# Altium schematic sheet BlancerCarMicrocontrollers.SchDoc
size A4
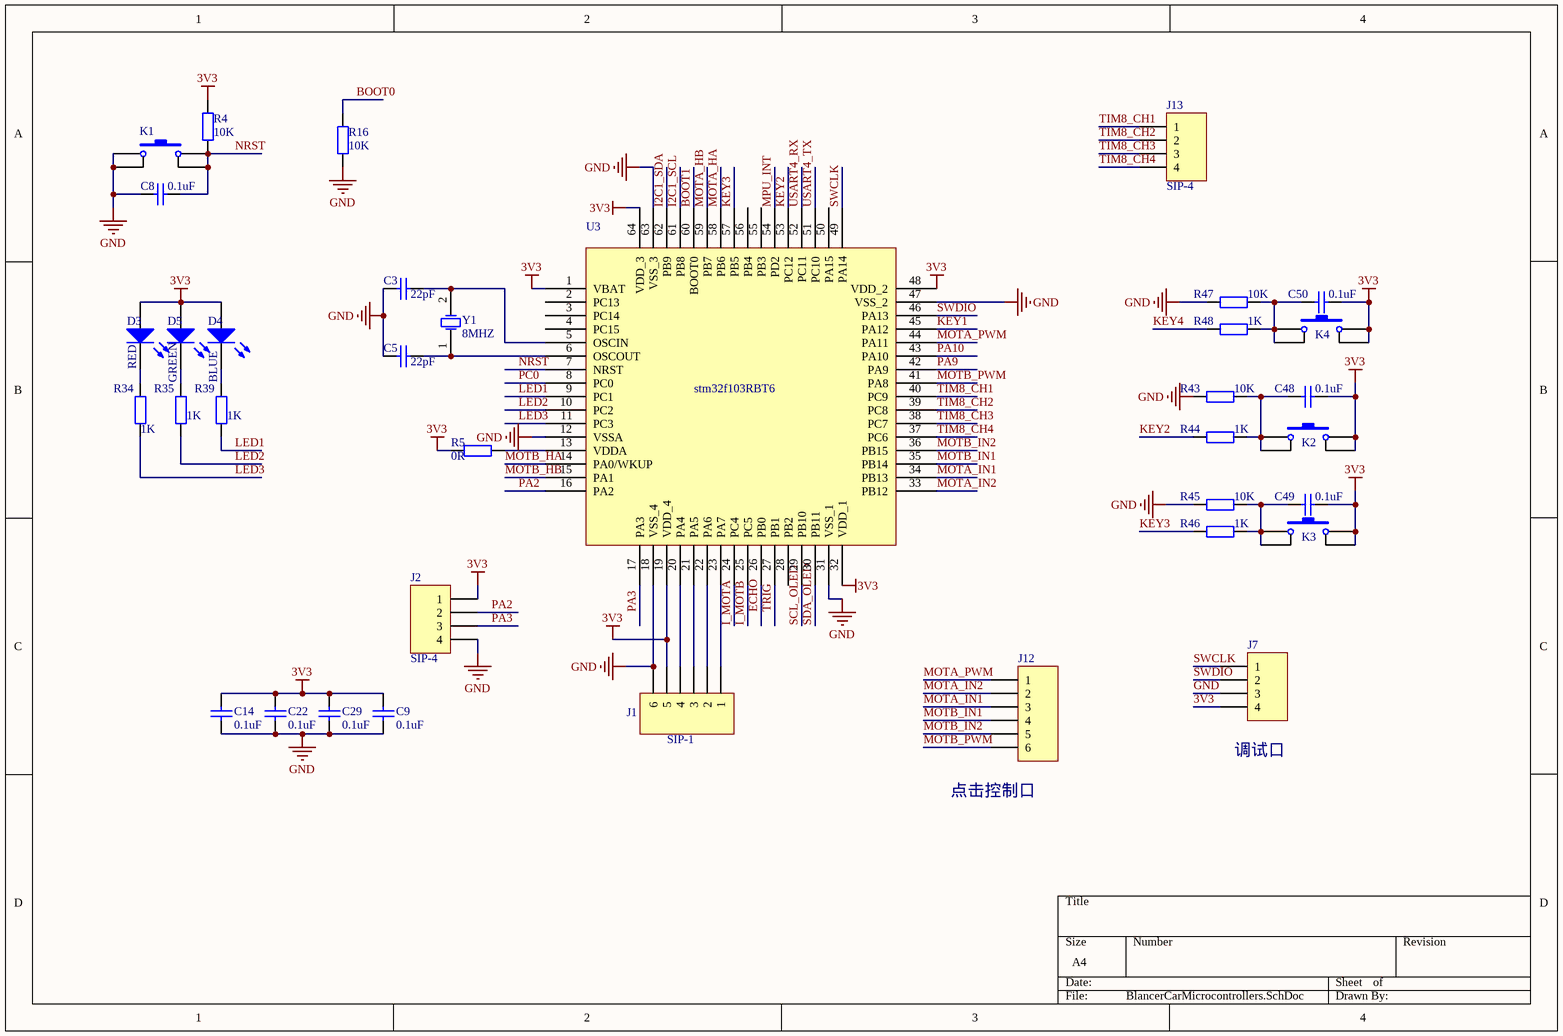
[diagram p0: BlancerCarMicrocontrollers.SchDoc]

## Parts
C3  value 22pF  [0805-1]  (hidden comment: Cap)
C5  value 22pF  [0805-1]  (hidden comment: Cap)
C8  value 0.1uF  [0805-1]  (hidden comment: Cap)
C9  value 0.1uF  [0805-1]  (hidden comment: Cap)
C14  value 0.1uF  [0805-1]  (hidden comment: Cap)
C22  value 0.1uF  [0805-1]  (hidden comment: Cap)
C29  value 0.1uF  [0805-1]  (hidden comment: Cap)
C48  value 0.1uF  [0805-1]  (hidden comment: Cap)
C49  value 0.1uF  [0805-1]  (hidden comment: Cap)
C50  value 0.1uF  [0805-1]  (hidden comment: Cap)
D3  RED  [LED_0805]
D4  BLUE  [LED_0805]
D5  GREEN  [LED_0805]
J1  SIP-1  [HDR1X6]
J2  SIP-4  [HDR1X4]
J7  Header 4  [HDR1X4]  (value not drawn)
J12  Header 6  [HDR1X6]  (value not drawn)
J13  SIP-4  [HDR1X4]
K1  SW-PB4  [SW_PB4_A1]  (value not drawn)
K2  SW-PB4  [SW_PB4_A1]  (value not drawn)
K3  SW-PB4  [SW_PB4_A1]  (value not drawn)
K4  SW-PB4  [SW_PB4_A1]  (value not drawn)
R4  value 10K  [0805-1]  (hidden comment: Res1)
R5  value 0R  [0805-1]  (hidden comment: Res1)
R16  value 10K  [0805-1]  (hidden comment: Res1)
R34  value 1K  [0805-1]  (hidden comment: Res1)
R35  value 1K  [0805-1]  (hidden comment: Res1)
R39  value 1K  [0805-1]  (hidden comment: Res1)
R43  value 10K  [0805-1]  (hidden comment: Res1)
R44  value 1K  [0805-1]  (hidden comment: Res1)
R45  value 10K  [0805-1]  (hidden comment: Res1)
R46  value 1K  [0805-1]  (hidden comment: Res1)
R47  value 10K  [0805-1]  (hidden comment: Res1)
R48  value 1K  [0805-1]  (hidden comment: Res1)
U3  stm32f103RBT6  [STM32F103RBT6(LQFP-64)]
Y1  8MHZ  [晶振 8M]

## Nets
3V3: C9.2 C14.2 C22.2 C29.2 C48.2 C49.2 C50.2 D3.1(A) D4.1(A) D5.1(A) J1.5 J2.1 J7.4 K2.2 K2.3 K3.2 K3.3 K4.2 K4.3 R4.1 R5.1 U3.1(VBAT) U3.19(VDD_4) U3.32(VDD_1) U3.48(VDD_2) U3.64(VDD_3)
GND: C3.1 C5.1 C8.1 C9.1 C14.1 C22.1 C29.1 J1.6 J2.4 J7.3 K1.1 K1.4 R16.1 R43.1 R45.1 R47.1 U3.12(VSSA) U3.18(VSS_4) U3.31(VSS_1) U3.47(VSS_2) U3.63(VSS_3)
BOOT0: R16.2
BOOT1: U3.60(BOOT0)
ECHO: U3.26(PB0)
I2C1_SCL: U3.61(PB8)
I2C1_SDA: U3.62(PB9)
I_MOTA: U3.24(PC4)
I_MOTB: U3.25(PC5)
KEY1: U3.45(PA12)
KEY2: R44.1 U3.53(PC12)
KEY3: R46.1 U3.57(PB5)
KEY4: R48.1
LED1: R39.1 U3.9(PC1)
LED2: R35.1 U3.10(PC2)
LED3: R34.1 U3.11(PC3)
MOTA_HA: U3.58(PB6)
MOTA_HB: U3.59(PB7)
MOTA_IN1: J12.3 U3.34(PB13)
MOTA_IN2: J12.2 U3.33(PB12)
MOTA_PWM: J12.1 U3.44(PA11)
MOTB_HA: U3.14(PA0/WKUP)
MOTB_HB: U3.15(PA1)
MOTB_IN1: J12.4 U3.35(PB14)
MOTB_IN2: J12.5 U3.36(PB15)
MOTB_PWM: J12.6 U3.41(PA8)
MPU_INT: U3.54(PD2)
NRST: C8.2 K1.2 K1.3 R4.2 U3.7(NRST)
PA2: J2.2 U3.16(PA2)
PA3: J2.3 U3.17(PA3)
PA9: U3.42(PA9)
PA10: U3.43(PA10)
PC0: U3.8(PC0)
SCL_OLED: U3.29(PB10)
SDA_OLED: U3.30(PB11)
SWCLK: J7.1 U3.49(PA14)
SWDIO: J7.2 U3.46(PA13)
TIM8_CH1: J13.1 U3.40(PC9)
TIM8_CH2: J13.2 U3.39(PC8)
TIM8_CH3: J13.3 U3.38(PC7)
TIM8_CH4: J13.4 U3.37(PC6)
TRIG: U3.27(PB1)
USART4_RX: U3.52(PC11)
USART4_TX: U3.51(PC10)
NetC3_2: C3.2 U3.5(OSCIN) Y1.2(OSC2)
NetC5_2: C5.2 U3.6(OSCOUT) Y1.1(OSC1)
NetC48_1: C48.1 K2.1 K2.4 R43.2 R44.2
NetC49_1: C49.1 K3.1 K3.4 R45.2 R46.2
NetC50_1: C50.1 K4.1 K4.4 R47.2 R48.2
NetD3_2: D3.2(K) R34.2
NetD4_2: D4.2(K) R39.2
NetD5_2: D5.2(K) R35.2
NetJ1_1: J1.1 U3.23(PA7)
NetJ1_2: J1.2 U3.22(PA6)
NetJ1_3: J1.3 U3.21(PA5)
NetJ1_4: J1.4 U3.20(PA4)
NetR5_2: R5.2 U3.13(VDDA)

Not connected (* = marked no-connect by the designer): U3 2(PC13) 3(PC14) 4(PC15) 28(PB2) 50(PA15) 55(PB3) 56(PB4)

## Notes on the sheet
- (near J7) 调试口
- (near J12) 点击控制口

## Library data of the parts
C3 C5 C8 C9 C14 C22 C29 C48-C50 = Cap: Capacitor; Published: 8-Jun-2000; LatestRevisionDate: 17-Jul-2002; LatestRevisionNote: Re-released for DXP Platform.; PackageReference: RAD-0.3; Publisher: Altium Limited
D3-D5 = LED0: 发光二极管; Published: 8-Jun-2000; LatestRevisionDate: 08-Jul-2005; LatestRevisionNote: Mech Layer 1 removed.; PackageReference: LED-0; Publisher: Altium Limited
J1 J12 = Header 6: Header, 6-Pin; LatestRevisionDate: 17-Jul-2002; LatestRevisionNote: Re-released for DXP Platform.; Publisher: Altium Limited
J2 J7 J13 = Header 4: Header, 4-Pin; LatestRevisionDate: 17-Jul-2002; LatestRevisionNote: Re-released for DXP Platform.; Publisher: Altium Limited
K1-K4 = SW-PB4: 微动开关; Published: 24-Mar-1999; LatestRevisionDate: 17-Jul-2002; LatestRevisionNote: Re-released for DXP Platform.; PackageReference: SPST-2; Publisher: Altium Limited
R4 R5 R16 R34 R35 R39 R43-R48 = Res1: 贴片电阻; Published: 8-Jun-2000; LatestRevisionDate: 17-Jul-2002; LatestRevisionNote: Re-released for DXP Platform.; PackageReference: AXIAL-0.4; Publisher: Altium Limited
Y1 = XTAL: Crystal Oscillator; Published: 8-Jun-2000; LatestRevisionDate: 17-Jul-2002; LatestRevisionNote: Re-released for DXP Platform.; PackageReference: R38; Publisher: Altium Limited; PackageDescription: Crystal, Thru-Hole; 2 Leads; Body 3.1 x 8.2 mm (Dia.xH)